# Altium schematic sheet [09] - REVISION HISTORY.SchDoc
size A3; DocumentNumber: 5; SheetNumber: 5; SheetTotal: 6
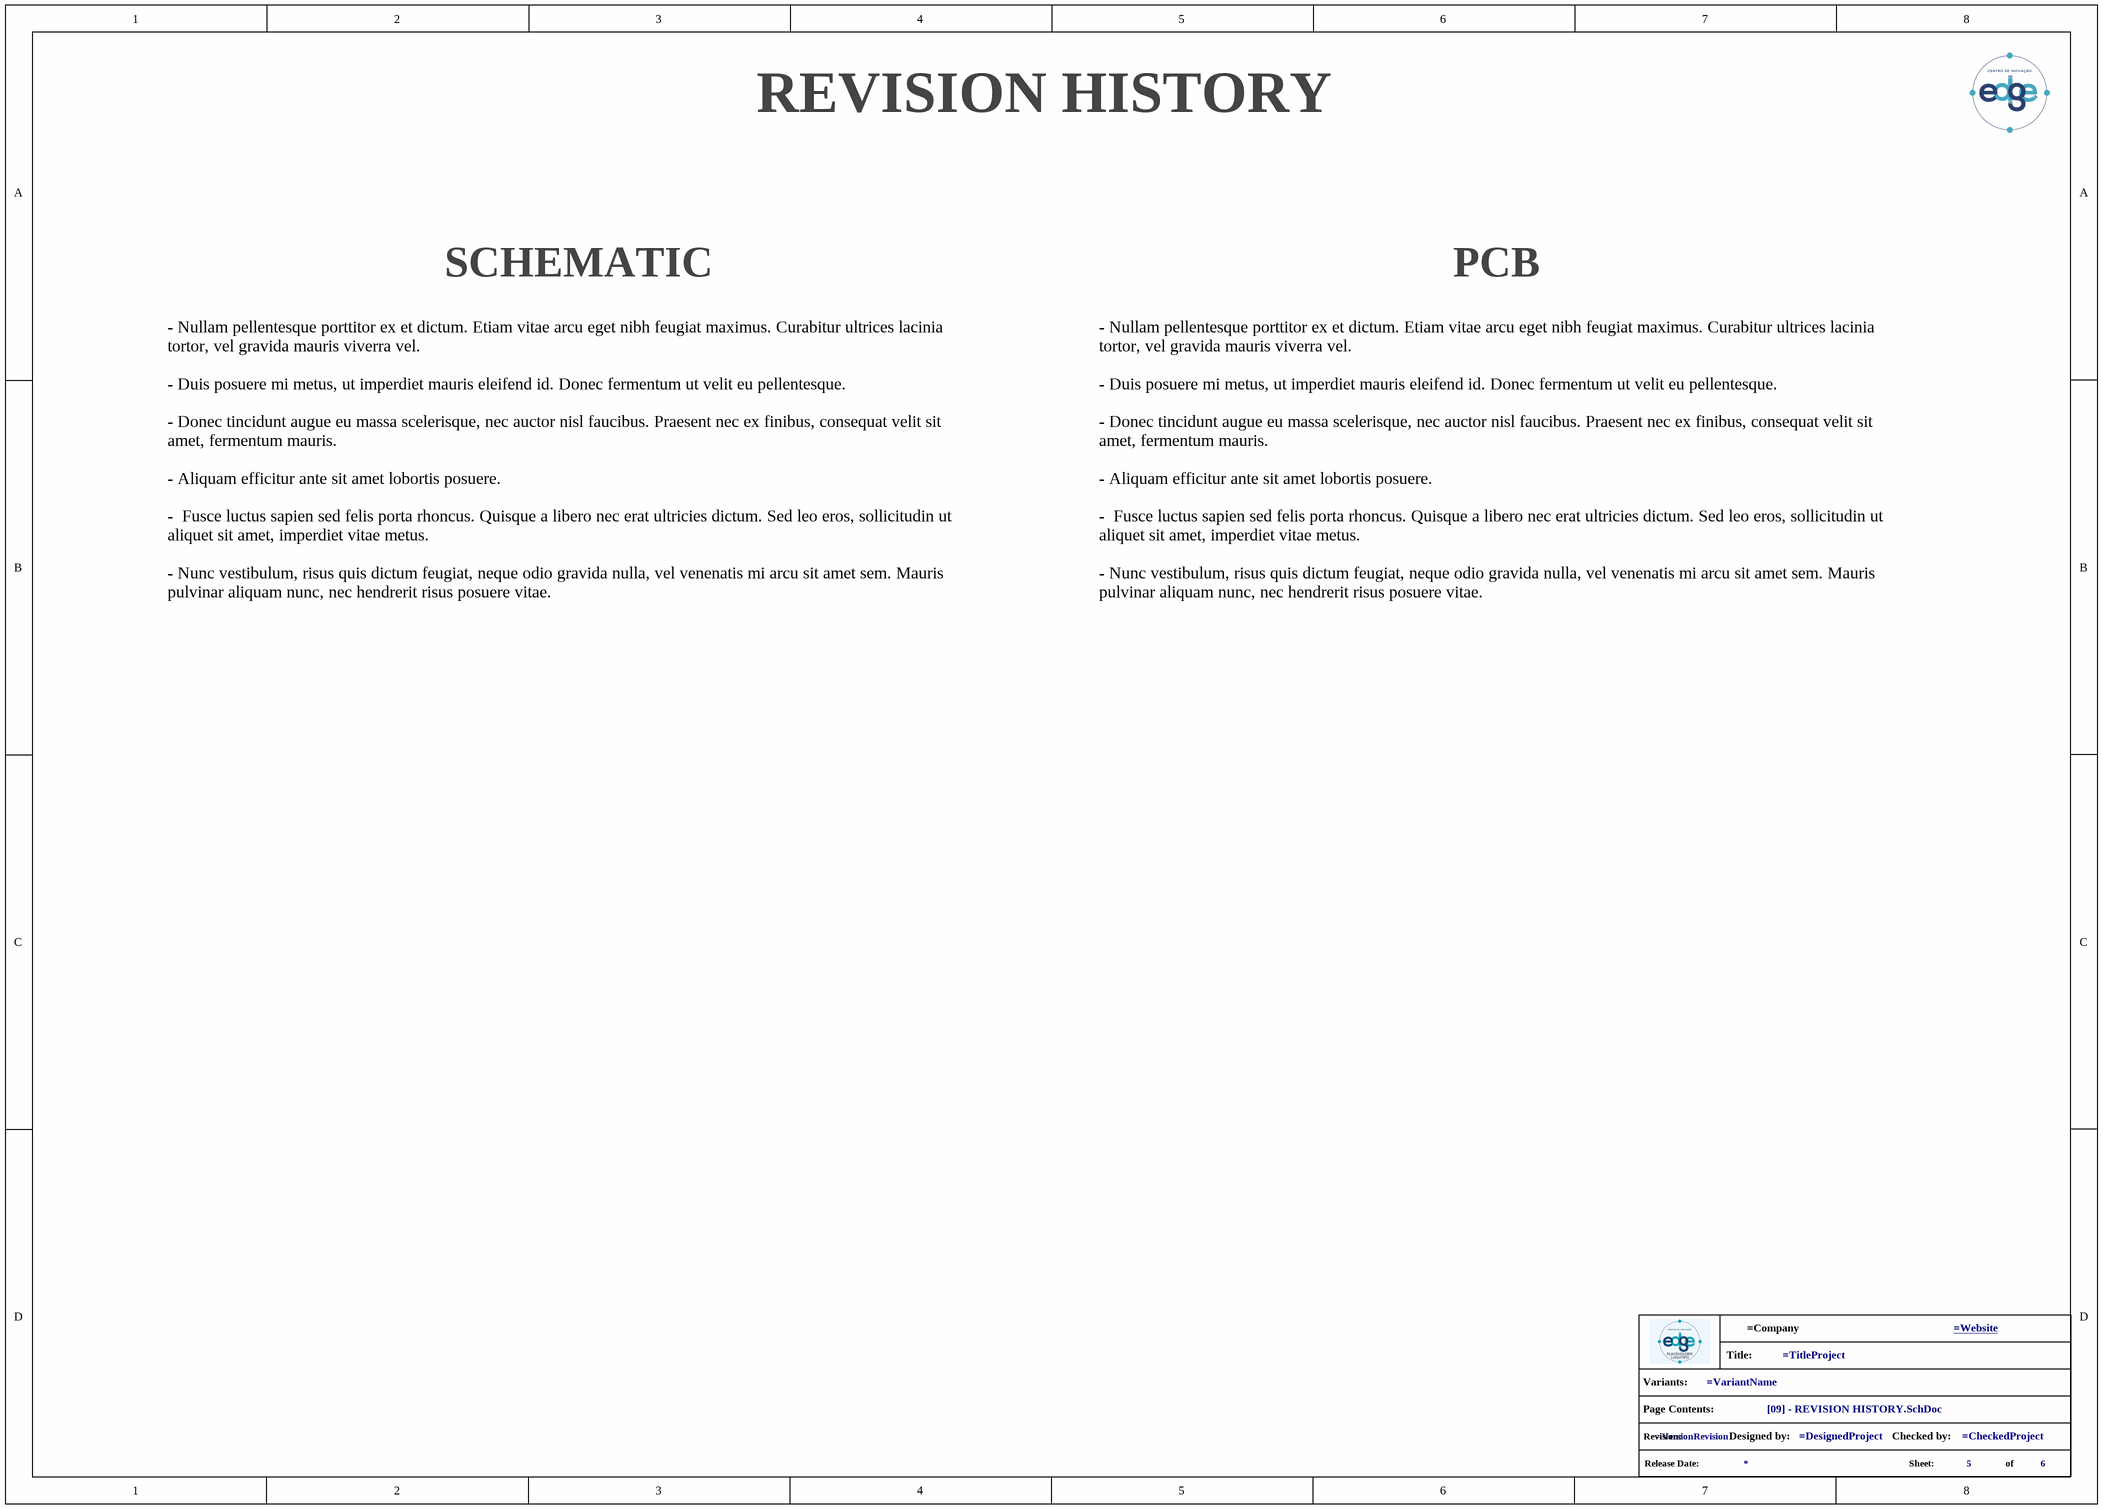
[diagram p0: [09] - REVISION HISTORY.SchDoc]

## Parts
*  info_project  (value not drawn)  (graphical)

## Notes on the sheet
- REVISION HISTORY
- SCHEMATIC
- PCB
- - Nullam pellentesque porttitor ex et dictum. Etiam vitae arcu eget nibh feugiat maximus. Curabitur ultrices lacinia tortor, vel gravida mauris viverra vel.
  - Duis posuere mi metus, ut imperdiet mauris eleifend id. Donec fermentum ut velit eu pellentesque.
  - Donec tincidunt augue eu massa scelerisque, nec auctor nisl faucibus. Praesent nec ex finibus, consequat velit sit amet, fermentum mauris.
  - Aliquam efficitur ante sit amet lobortis posuere.
  -  Fusce luctus sapien sed felis porta rhoncus. Quisque a libero nec erat ultricies dictum. Sed leo eros, sollicitudin ut aliquet sit amet, imperdiet vitae metus.
  - Nunc vestibulum, risus quis dictum feugiat, neque odio gravida nulla, vel venenatis mi arcu sit amet sem. Mauris pulvinar aliquam nunc, nec hendrerit risus posuere vitae.
- (in symbol info_project) Title:; Variants:; Page Contents:; Revision:; Designed by:; Checked by:; Release Date:; Sheet:; of